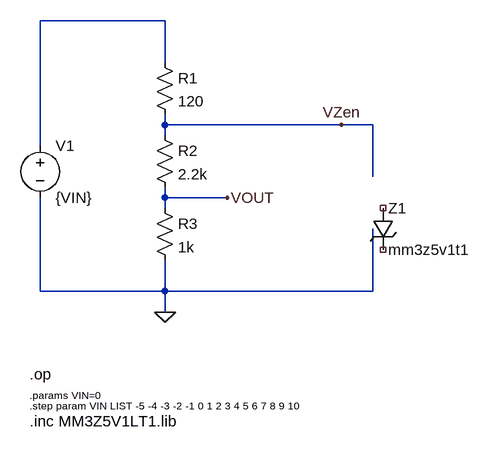
[diagram p0: schematic input-protection.asc]
input-protection.asc, the LTspice schematic file:
Version 4
SHEET 1 880 680
WIRE 256 -16 64 -16
WIRE 256 48 256 -16
WIRE 256 144 256 128
WIRE 528 144 256 144
WIRE 576 144 528 144
WIRE 256 160 256 144
WIRE 64 176 64 -16
WIRE 576 224 576 144
WIRE 256 256 256 240
WIRE 352 256 256 256
WIRE 256 272 256 256
WIRE 64 400 64 256
WIRE 256 400 256 352
WIRE 256 400 64 400
WIRE 576 400 576 304
WIRE 576 400 256 400
WIRE 256 432 256 400
FLAG 256 432 0
FLAG 352 256 VOUT
FLAG 528 144 VZen
SYMBOL res 240 32 R0
SYMATTR InstName R1
SYMATTR Value 120
SYMBOL res 240 144 R0
SYMATTR InstName R2
SYMATTR Value 2.2k
SYMBOL res 240 256 R0
SYMATTR InstName R3
SYMATTR Value 1k
SYMBOL voltage 64 160 R0
WINDOW 123 0 0 Left 2
WINDOW 39 0 0 Left 2
SYMATTR InstName V1
SYMATTR Value {VIN}
SYMBOL zener 576 272 R0
SYMATTR InstName Z1
SYMATTR Prefix X
SYMATTR Value mm3z5v1t1
TEXT 48 528 Left 2 !.op
TEXT 48 560 Left 1 !.params VIN=0
TEXT 48 576 Left 1 !.step param VIN LIST -5 -4 -3 -2 -1 0 1 2 3 4 5 6 7 8 9 10
TEXT 48 600 Left 2 !.inc MM3Z5V1LT1.lib

The netlist it stands for:
* input-protection.asc
R1 N001 VZen 120
R2 VZen VOUT 2.2k
R3 VOUT 0 1k
V1 N001 0 {VIN}
XZ1 NC_01 NC_02 mm3z5v1t1  ; pins + -
.op
.params VIN=0
.step param VIN LIST -5 -4 -3 -2 -1 0 1 2 3 4 5 6 7 8 9 10
.inc MM3Z5V1LT1.lib
.backanno
.end